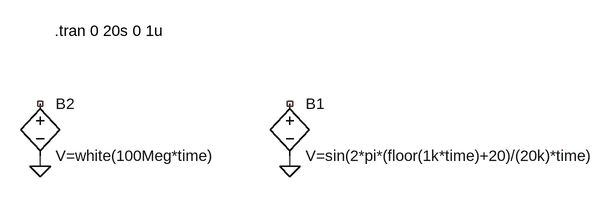
[diagram p0: schematic FuentesRaras.asc]
FuentesRaras.asc, the LTspice schematic file:
Version 4
SHEET 1 880 680
WIRE -288 224 -288 208
WIRE 96 224 96 208
FLAG 96 224 0
FLAG -288 224 0
SYMBOL bv 96 112 R0
SYMATTR InstName B1
SYMATTR Value V=sin(2*pi*(floor(1k*time)+20)/(20k)*time)
SYMBOL bv -288 112 R0
SYMATTR InstName B2
SYMATTR Value V=white(100Meg*time)
TEXT -266 16 Left 2 !.tran 0 20s 0 1u

The netlist it stands for:
* FuentesRaras.asc
B1 NC_01 0 V=sin(2*pi*(floor(1k*time)+20)/(20k)*time)
B2 NC_02 0 V=white(100Meg*time)
.tran 0 20s 0 1u
.backanno
.end